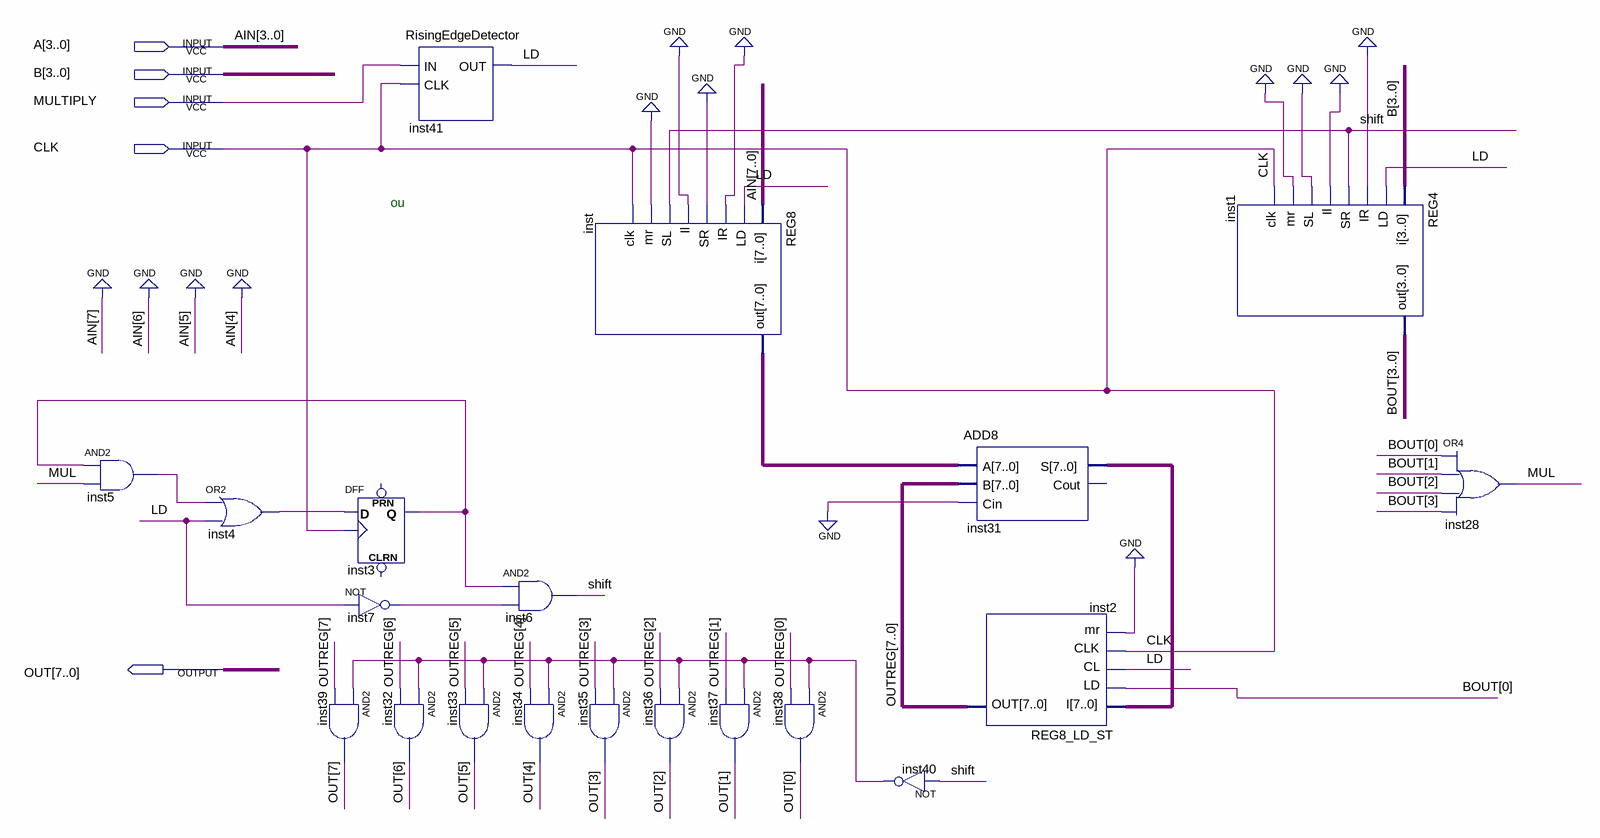
[diagram p0: schematic sheet]
// Quartus schematic MUL1.bdf as structural Verilog: 20 symbols, 5 pins
module MUL1 (
  input  [3:0] A,
  input  [3:0] B,
  input  MULTIPLY,
  input  CLK,
  output [7:0] OUT
);

  wire inst3_q, inst4_out, inst5_out, inst7_out, inst40_out, LD, MUL, shift;
  wire [3:0] BOUT;
  wire [7:0] inst31_s, inst_out, OUTREG;

  and inst5 (inst5_out, inst3_q, MUL);
  or inst4 (inst4_out, inst5_out, LD);
  and inst39 (OUT[7], inst40_out, OUTREG[7]);
  DFF inst3 (.CLK(CLK), .D(inst4_out), .Q(inst3_q));  // open: CLRN, PRN
  not inst7 (inst7_out, LD);
  and inst32 (OUT[6], inst40_out, OUTREG[6]);
  RisingEdgeDetector inst41 (.IN(MULTIPLY), .CLK(CLK), .OUT(LD));
  and inst33 (OUT[5], inst40_out, OUTREG[5]);
  and inst6 (shift, inst3_q, inst7_out);
  and inst34 (OUT[4], inst40_out, OUTREG[4]);
  REG8 inst (
    .i({4'b0000, A}), .LD(LD), .IR(1'b0), .SR(1'b0), .Il(1'b0), .SL(shift), .mr(1'b0), .clk(CLK),
    .out(inst_out));
  and inst35 (OUT[3], inst40_out, OUTREG[3]);
  and inst36 (OUT[2], inst40_out, OUTREG[2]);
  and inst37 (OUT[1], inst40_out, OUTREG[1]);
  and inst38 (OUT[0], inst40_out, OUTREG[0]);
  not inst40 (inst40_out, shift);
  ADD8 inst31 (.A(inst_out), .B(OUTREG), .Cin(1'b0), .S(inst31_s));  // open: Cout
  REG8_LD_ST inst2 (.I(inst31_s), .LD(BOUT[0]), .CL(LD), .CLK(CLK), .mr(1'b0), .OUT(OUTREG));
  REG4 inst1 (.i(B), .LD(LD), .IR(1'b0), .SR(shift), .Il(1'b0), .SL(1'b0), .mr(1'b0), .clk(CLK), .out(BOUT));
  or inst28 (MUL, BOUT[0], BOUT[1], BOUT[2], BOUT[3]);

  // Other names for the same wires on the sheet: AIN[3:0] = A

  // Notes on the sheet:
  //   ou
endmodule
